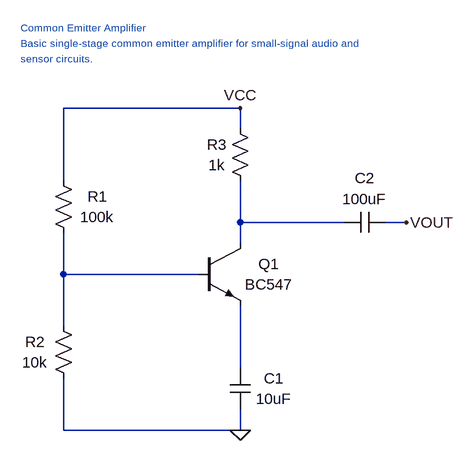
[diagram p0: schematic common_emitter_amplifier.asc]
common_emitter_amplifier.asc, the LTspice schematic file:
Version 4
SHEET 1 736 720
SYMBOL cap 496 528 R0
WINDOW 0 68 16 Center 2
WINDOW 3 68 48 Center 2
SYMATTR InstName C1
SYMATTR Value 10uF
SYMBOL cap 672 320 R270
WINDOW 0 84 32 VCenter 2
WINDOW 3 52 32 VCenter 2
SYMATTR InstName C2
SYMATTR Value 100uF
SYMBOL npn 448 336 R0
WINDOW 0 108 32 Center 2
WINDOW 3 108 64 Center 2
SYMATTR InstName Q1
SYMATTR Value BC547
SYMBOL res 224 224 R0
WINDOW 0 68 40 Center 2
WINDOW 3 68 72 Center 2
SYMATTR InstName R1
SYMATTR Value 100k
SYMBOL res 224 448 R0
WINDOW 0 -28 40 Center 2
WINDOW 3 -28 72 Center 2
SYMATTR InstName R2
SYMATTR Value 10k
SYMBOL res 528 256 R180
WINDOW 0 52 72 Center 2
WINDOW 3 52 40 Center 2
SYMATTR InstName R3
SYMATTR Value 1k
WIRE 240 128 240 240
WIRE 240 128 512 128
WIRE 240 320 240 384
WIRE 240 384 240 464
WIRE 240 384 448 384
WIRE 240 544 240 624
WIRE 240 624 512 624
WIRE 512 128 512 160
WIRE 512 240 512 304
WIRE 512 304 512 336
WIRE 512 304 672 304
WIRE 512 432 512 528
WIRE 512 592 512 624
WIRE 736 304 768 304
FLAG 512 624 0
FLAG 512 128 VCC
FLAG 768 304 VOUT
TEXT 174 4 Left 1 ;Common Emitter Amplifier
TEXT 174 28 Left 1 ;Basic single-stage common emitter amplifier for small-signal audio and
TEXT 174 52 Left 1 ;sensor circuits.

The netlist it stands for:
* common_emitter_amplifier.asc
C1 N003 0 10uF
C2 N002 VOUT 100uF
Q1 N002 N001 N003 0 BC547
R1 VCC N001 100k
R2 N001 0 10k
R3 N002 VCC 1k
.model NPN NPN
.model PNP PNP
.lib standard.bjt
* Common Emitter Amplifier
* Basic single-stage common emitter amplifier for small-signal audio and
* sensor circuits.
.backanno
.end